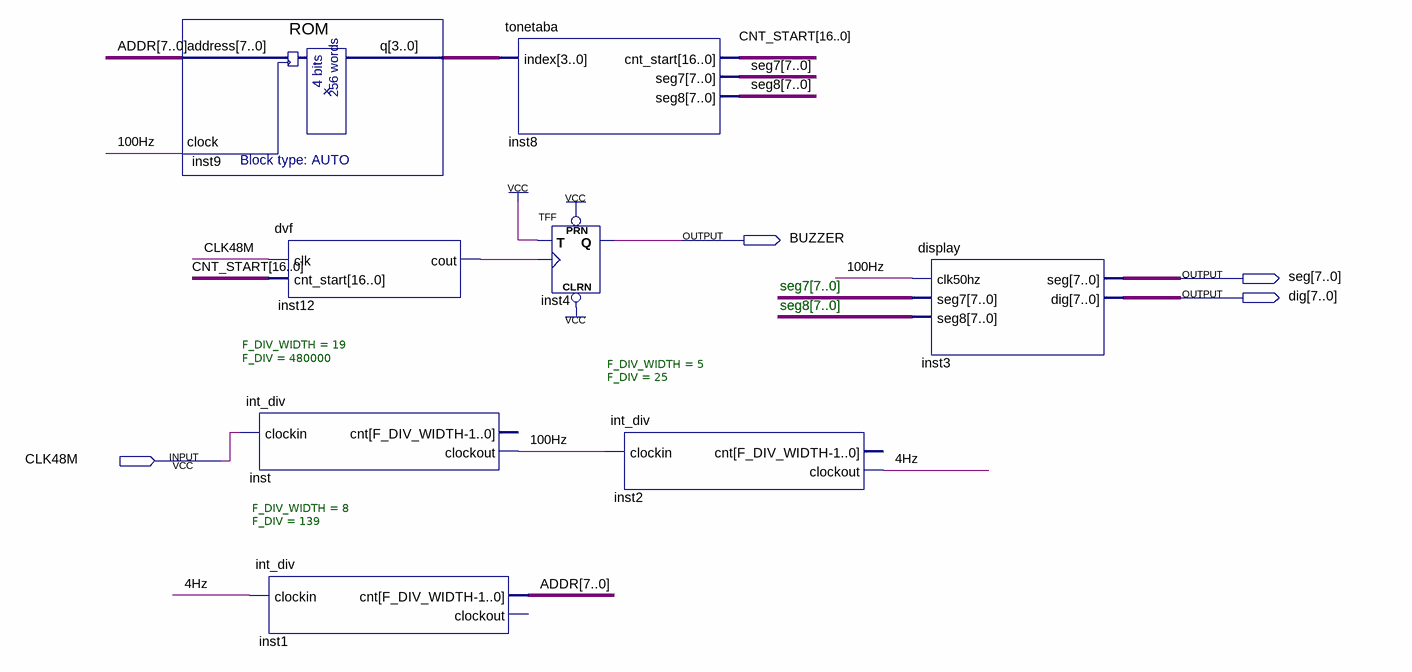
[diagram p0: schematic sheet]
// Quartus schematic music.bdf as structural Verilog: 8 symbols, 4 pins
module music (
  input  CLK48M,
  output BUZZER,
  output [7:0] seg,
  output [7:0] dig
);

  wire \4Hz , \100Hz , inst12_cout;
  wire [3:0] inst9_q;
  wire [7:0] ADDR, seg7, seg8;
  wire [16:0] CNT_START;

  ROM inst9 (.address(ADDR), .clock(\100Hz ), .q(inst9_q));
  int_div #(.F_DIV_WIDTH(19), .F_DIV(480000)) inst (.clockin(CLK48M), .clockout(\100Hz ));  // open: cnt
  int_div #(.F_DIV_WIDTH(8), .F_DIV(139)) inst1 (.clockin(\4Hz ), .cnt(ADDR));  // open: clockout
  dvf inst12 (.clk(CLK48M), .cnt_start(CNT_START), .cout(inst12_cout));
  tonetaba inst8 (.index(inst9_q), .cnt_start(CNT_START), .seg7(seg7), .seg8(seg8));
  TFF inst4 (.PRN(1'b1), .CLRN(1'b1), .T(1'b1), .CLK(inst12_cout), .Q(BUZZER));
  int_div #(.F_DIV_WIDTH(5), .F_DIV(25)) inst2 (.clockin(\100Hz ), .clockout(\4Hz ));  // open: cnt
  display inst3 (.clk50hz(\100Hz ), .seg7(seg7), .seg8(seg8), .seg(seg), .dig(dig));

  // Notes on the sheet:
  //   seg7[7..0]
  //   seg8[7..0]
endmodule
